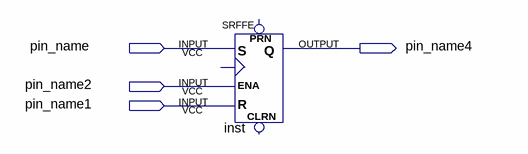
[diagram p0: schematic sheet]
// Quartus schematic Block1.bdf as structural Verilog: 1 symbols, 4 pins
module Block1 (
  input  pin_name,
  input  pin_name2,
  input  pin_name1,
  output pin_name4
);

  SRFFE inst (.S(pin_name), .R(pin_name1), .ENA(pin_name2), .Q(pin_name4));  // open: PRN, CLK, CLRN
endmodule
